# EAGLE design MaxO (EAGLE 5.04)
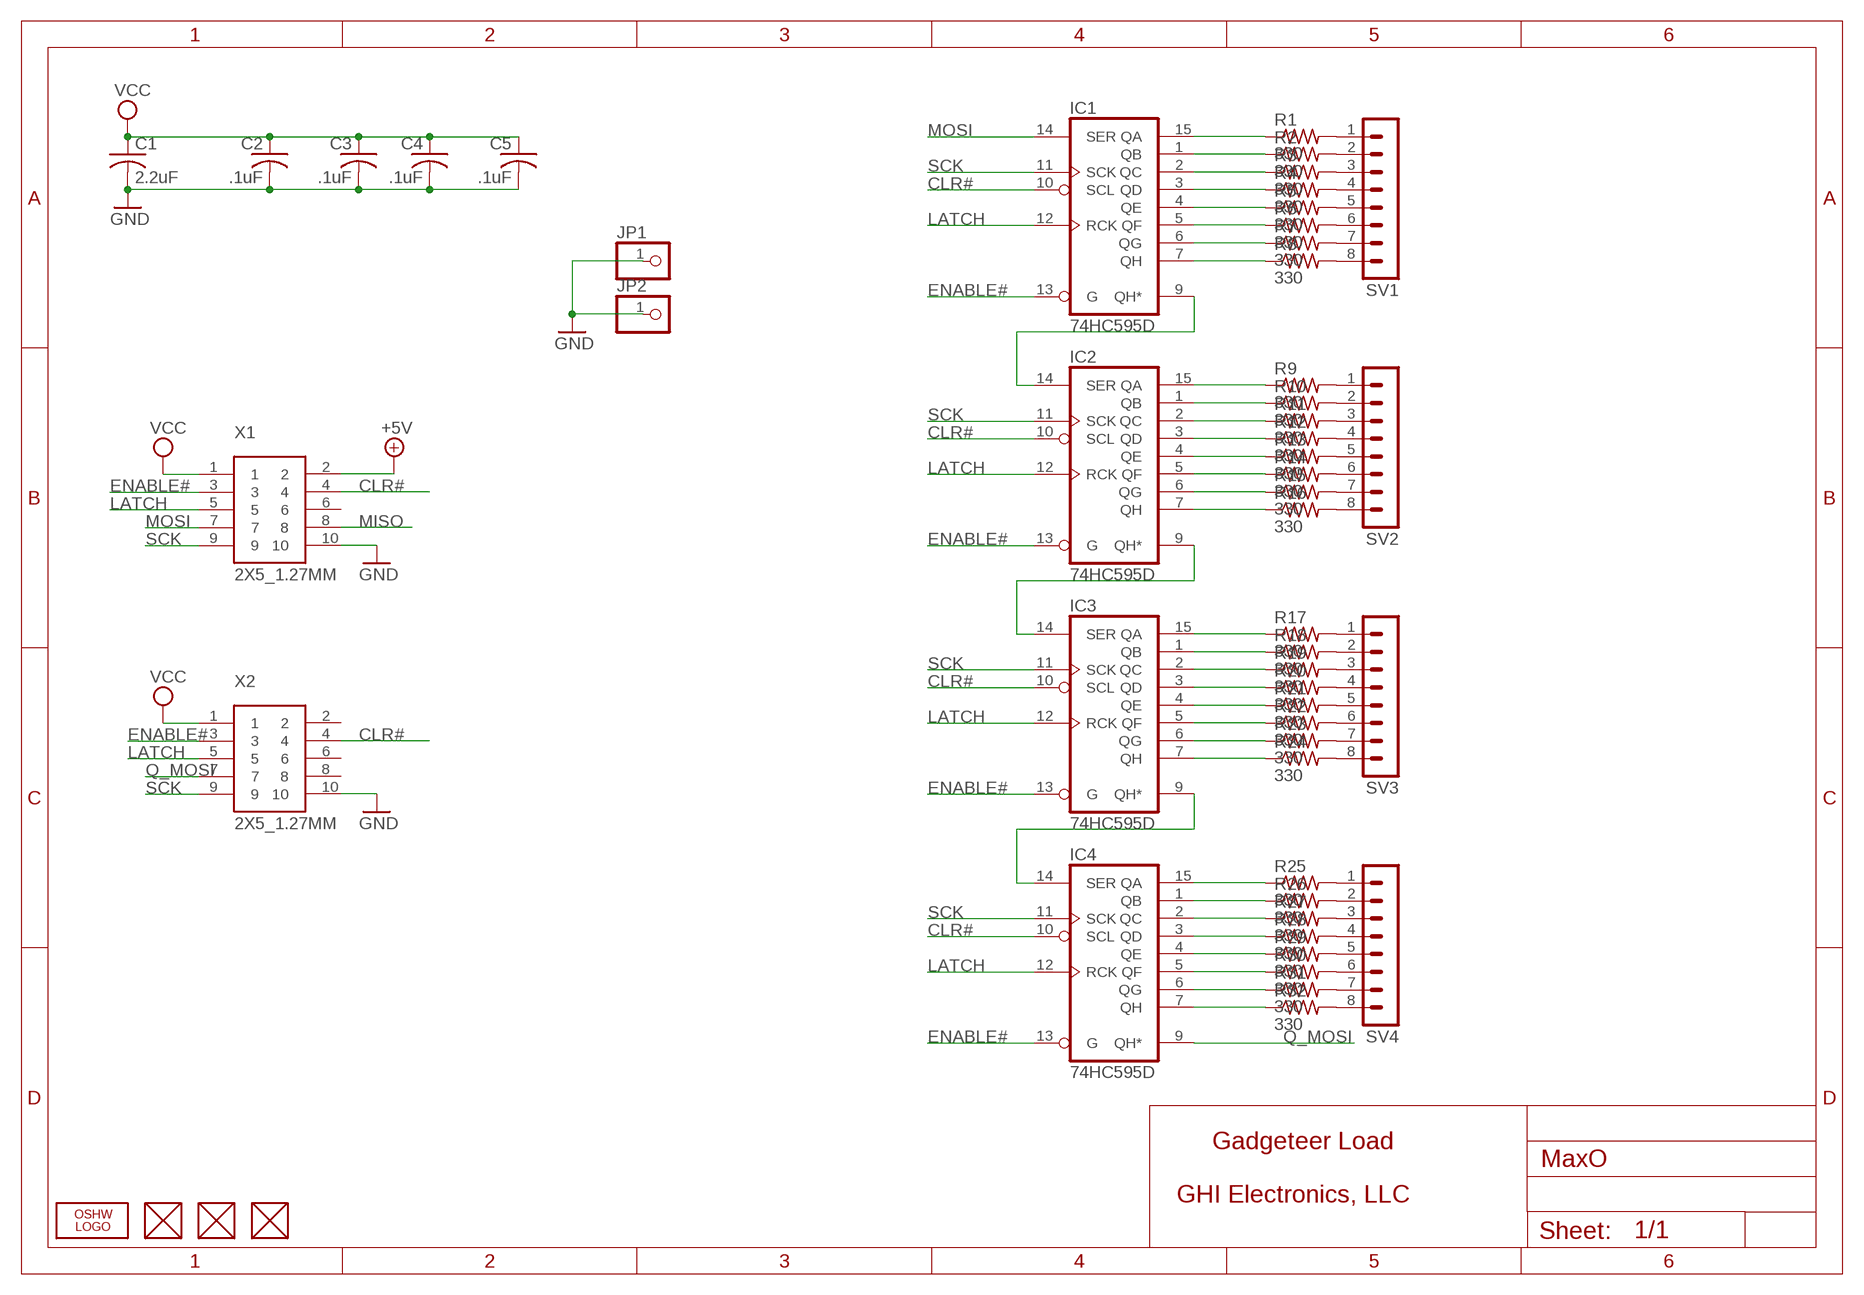
[diagram p0: schematic, sheet 1]

## Parts
C1  2.2uF  C-USC0805K  [C0805K]
C2  .1uF  C-USC0603K  [C0603K]
C3  .1uF  C-USC0603K  [C0603K]
C4  .1uF  C-USC0603K  [C0603K]
C5  .1uF  C-USC0603K  [C0603K]
FUD1  FIDUCIAL  [FIDUCIAL_40MIL]
FUD2  FIDUCIAL  [FIDUCIAL_40MIL]
FUD3  FIDUCIAL  [FIDUCIAL_40MIL]
IC1  74HC595D  74LS595D  [SO16]
IC2  74HC595D  74LS595D  [SO16]
IC3  74HC595D  74LS595D  [SO16]
IC4  74HC595D  74LS595D  [SO16]
JP1  PINHD-1X1  [1X01]
JP2  PINHD-1X1  [1X01]
LOGO1  LOGO-OSHW-FILLX0200-NT  [OSHW_FILLX200_NOTEXT]
R1  330  R-US_R0603  [R0603]
R2  330  R-US_R0603  [R0603]
R3  330  R-US_R0603  [R0603]
R4  330  R-US_R0603  [R0603]
R5  330  R-US_R0603  [R0603]
R6  330  R-US_R0603  [R0603]
R7  330  R-US_R0603  [R0603]
R8  330  R-US_R0603  [R0603]
R9  330  R-US_R0603  [R0603]
R10  330  R-US_R0603  [R0603]
R11  330  R-US_R0603  [R0603]
R12  330  R-US_R0603  [R0603]
R13  330  R-US_R0603  [R0603]
R14  330  R-US_R0603  [R0603]
R15  330  R-US_R0603  [R0603]
R16  330  R-US_R0603  [R0603]
R17  330  R-US_R0603  [R0603]
R18  330  R-US_R0603  [R0603]
R19  330  R-US_R0603  [R0603]
R20  330  R-US_R0603  [R0603]
R21  330  R-US_R0603  [R0603]
R22  330  R-US_R0603  [R0603]
R23  330  R-US_R0603  [R0603]
R24  330  R-US_R0603  [R0603]
R25  330  R-US_R0603  [R0603]
R26  330  R-US_R0603  [R0603]
R27  330  R-US_R0603  [R0603]
R28  330  R-US_R0603  [R0603]
R29  330  R-US_R0603  [R0603]
R30  330  R-US_R0603  [R0603]
R31  330  R-US_R0603  [R0603]
R32  330  R-US_R0603  [R0603]
SV1  MA08-1  [MA08-1]
SV2  MA08-1  [MA08-1]
SV3  MA08-1  [MA08-1]
SV4  MA08-1  [MA08-1]
X1  2X5_1.27MM  [2X5_1.27MM]
X2  2X5_1.27MM  [2X5_1.27MM]

## Nets
+5V [power]: X1.2
CLR#: IC1.10(SCL) IC2.10(SCL) IC3.10(SCL) IC4.10(SCL) X1.4 X2.4
ENABLE#: IC1.13(G) IC2.13(G) IC3.13(G) IC4.13(G) X1.3 X2.3
GND [power]: C1.2 C2.2 C3.2 C4.2 C5.2 JP1.1 JP2.1 X1.10 X2.10
LATCH: IC1.12(RCK) IC2.12(RCK) IC3.12(RCK) IC4.12(RCK) X1.5 X2.5
MISO: X1.8
MOSI: IC1.14(SER) X1.7
N$1: IC1.15(QA) R1.1
N$2: IC1.1(QB) R2.1
N$3: IC1.2(QC) R3.1
N$4: IC1.3(QD) R4.1
N$5: IC1.4(QE) R5.1
N$6: IC1.5(QF) R6.1
N$7: IC1.6(QG) R7.1
N$8: IC1.7(QH) R8.1
N$9: IC2.15(QA) R9.1
N$10: IC2.1(QB) R10.1
N$11: IC2.2(QC) R11.1
N$12: IC2.3(QD) R12.1
N$13: IC2.4(QE) R13.1
N$14: IC2.5(QF) R14.1
N$15: IC2.6(QG) R15.1
N$17: IC2.7(QH) R16.1
N$18: IC3.15(QA) R17.1
N$19: IC3.1(QB) R18.1
N$20: IC3.2(QC) R19.1
N$21: IC3.3(QD) R20.1
N$22: IC3.4(QE) R21.1
N$23: IC3.5(QF) R22.1
N$24: IC1.9(QH*) IC2.14(SER)
N$25: IC2.9(QH*) IC3.14(SER)
N$26: IC3.9(QH*) IC4.14(SER)
N$27: R1.2 SV1.1
N$28: R2.2 SV1.2
N$29: R3.2 SV1.3
N$30: IC3.6(QG) R23.1
N$31: IC3.7(QH) R24.1
N$32: IC4.15(QA) R25.1
N$33: IC4.1(QB) R26.1
N$34: IC4.2(QC) R27.1
N$35: IC4.3(QD) R28.1
N$36: IC4.4(QE) R29.1
N$37: IC4.5(QF) R30.1
N$38: IC4.6(QG) R31.1
N$39: IC4.7(QH) R32.1
N$40: R4.2 SV1.4
N$41: R5.2 SV1.5
N$42: R6.2 SV1.6
N$43: R7.2 SV1.7
N$44: R8.2 SV1.8
N$45: R32.2 SV4.8
N$46: R31.2 SV4.7
N$47: R30.2 SV4.6
N$48: R28.2 SV4.4
N$49: R29.2 SV4.5
N$50: R27.2 SV4.3
N$51: R26.2 SV4.2
N$52: R25.2 SV4.1
N$53: R24.2 SV3.8
N$54: R23.2 SV3.7
N$55: R22.2 SV3.6
N$56: R21.2 SV3.5
N$57: R20.2 SV3.4
N$58: R18.2 SV3.2
N$59: R19.2 SV3.3
N$60: R17.2 SV3.1
N$61: R16.2 SV2.8
N$62: R14.2 SV2.6
N$63: R13.2 SV2.5
N$64: R12.2 SV2.4
N$65: R11.2 SV2.3
N$66: R10.2 SV2.2
N$67: R9.2 SV2.1
N$68: R15.2 SV2.7
Q_MOSI: IC4.9(QH*) X2.7
SCK: IC1.11(SCK) IC2.11(SCK) IC3.11(SCK) IC4.11(SCK) X1.9 X2.9
VCC [power]: C1.1 C2.1 C3.1 C4.1 C5.1 X1.1 X2.1
Unconnected: FUD1.P$1 FUD2.P$1 FUD3.P$1 X1.6 X2.2 X2.6 X2.8

## Notes on the sheet
- Gadgeteer Load
- GHI Electronics, LLC

## Power pins joined to a net without a drawn wire
GND: IC1.8(GND) IC2.8(GND) IC3.8(GND) IC4.8(GND)
VCC: IC1.16(VCC) IC2.16(VCC) IC3.16(VCC) IC4.16(VCC)

## Library data of the parts
C1-C5 = rcl:C-US: CAPACITOR, American symbol
FUD1-FUD3 = GHI:FIDUCIAL
IC1-IC4 = 74xx-us:74*595: 8-bit SHIFT REGISTER, output latch
JP1 JP2 = pinhead:PINHD-1X1: PIN HEADER
LOGO1 = Logo:LOGO-OSHW-FILL
R1-R32 = rcl:R-US_: RESISTOR, American symbol
SV1-SV4 = con-lstb:MA08-1: PIN HEADER
X1 X2 = GHI:2X5_1.27MM

## Board
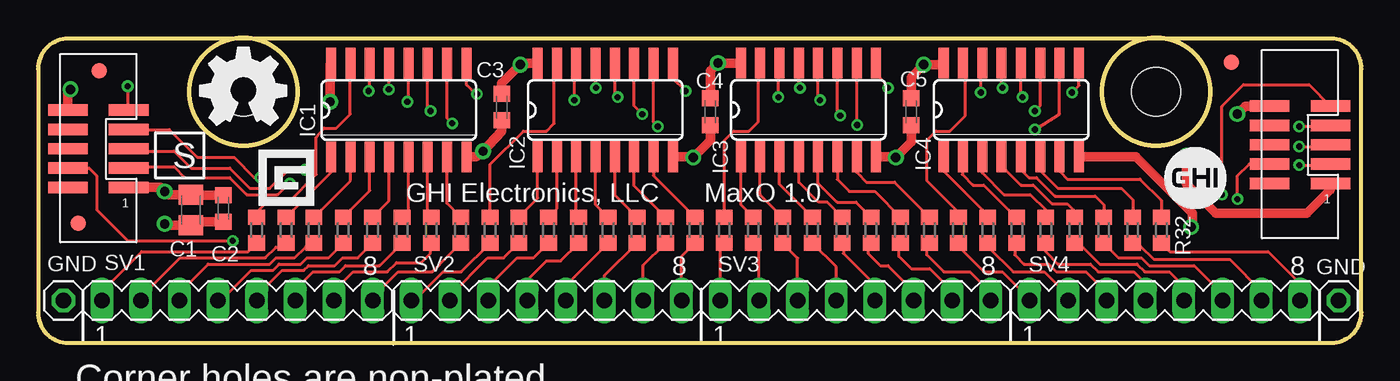
[diagram p1: board, top side]
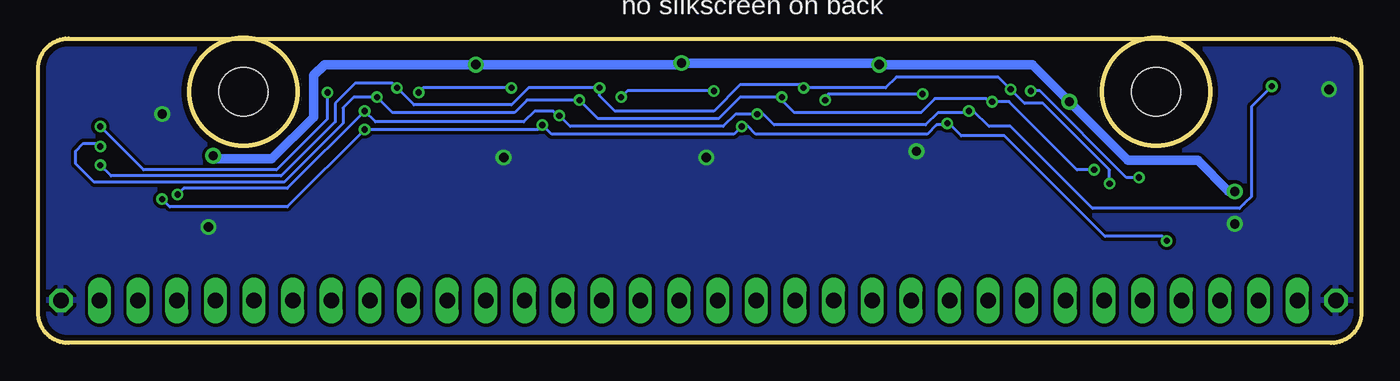
[diagram p2: board, bottom side, seen from below]

Size 87 x 20.04 mm. Coordinates in mm from the lower left corner, seen from the top.
Outline: 0,2 arc90 2,0 85,0 arc90 87,2 87,18 arc90 85,20 2,20 arc90 0,18 0,2
Outline: circle at 73.5,16.5 radius 3.54
Outline: circle at 13.5,16.5 radius 3.54
Copper layers (1+16): Top 0.035mm / dielectric 1.5mm / Bottom 0.035mm
Design rules "default *": minimum track width 8mil, minimum drill 12mil, track to track 8mil, track to pad 8mil, pad to pad 8mil, via to via 8mil, smd to smd 8mil, copper to edge 15mil, drill to drill 8mil, minimum pad ring 10mil, minimum via ring 7mil, stop-mask expansion 4mil, vias tented up to drill 50mil, thermal gap 10mil
Holes 3.2 mm at 13.5,16.5 73.5,16.5

### Footprints (pad centres in the part's own frame; a part is rotated, then mirrored left to right if it is on the bottom)
C0805K = smd 1.3 x 1.6: 1 -1,0; 2 1,0
C0603K = smd 1.05 x 1.08: 1 -0.875,0; 2 0.875,0
FIDUCIAL_40MIL = smd 1.016 x 1.016: P$1 0,0
SO16 = smd 0.66 x 2.032: 1 -4.445,-3.073; 2 -3.175,-3.073; 3 -1.905,-3.073; 4 -0.635,-3.073; 5 0.635,-3.073; 6 1.905,-3.073; 7 3.175,-3.073; 8 4.445,-3.073; 9 4.445,3.073; 10 3.175,3.073; 11 1.905,3.073; 12 0.635,3.073; 13 -0.635,3.073; 14 -1.905,3.073; 15 -3.175,3.073; 16 -4.445,3.073
1X01 = drill 1.016 octagon: 1 0,0
R0603 = smd 1 x 1.1: 1 -0.85,0; 2 0.85,0
MA08-1 = drill 1.016 long: 1 -8.89,0; 2 -6.35,0; 3 -3.81,0; 4 -1.27,0; 5 1.27,0; 6 3.81,0; 7 6.35,0; 8 8.89,0
2X5_1.27MM = smd 2.6 x 0.74: 1 -2,2.58; 2 2,2.58; 3 -2,1.31; 4 2,1.31; 5 -2,0.04; 6 2,0.04; 7 -2,-1.23; 8 2,-1.23; 9 -2,-2.5; 10 2,-2.5

### Placement (x,y rotation side)
C1  10.06,8.74 270 top
C2  12.19,8.84 270 top
C3  30.48,15.49 270 top
C4  44.2,15.19 270 top
C5  57.4,15.19 270 top
FUD1  78.46,18.43 0 top
FUD2  4.01,17.89 0 top
FUD3  2.63,7.86 0 top
IC1  23.71,15.29 0 top
IC2  37.28,15.3 0 top
IC3  50.64,15.32 0 top
IC4  63.98,15.32 0 top
JP1  1.68,2.79 0 top
JP2  85.5,2.79 0 top
LOGO1  10.66,14.33 0 top
R1  14.38,7.42 270 top
R2  16.31,7.42 270 top
R3  18.14,7.42 270 top
R4  20.07,7.42 270 top
R5  22,7.42 270 top
R6  23.93,7.42 270 top
R7  25.86,7.42 270 top
R8  27.79,7.42 270 top
R9  29.72,7.42 270 top
R10  31.6,7.42 270 top
R11  33.55,7.42 270 top
R12  35.53,7.42 270 top
R13  37.47,7.42 270 top
R14  39.37,7.42 270 top
R15  41.25,7.42 270 top
R16  43.18,7.42 270 top
R17  45.11,7.42 270 top
R18  47.02,7.42 270 top
R19  48.95,7.42 270 top
R20  50.9,7.42 270 top
R21  52.86,7.42 270 top
R22  54.76,7.42 270 top
R23  56.69,7.42 270 top
R24  58.6,7.42 270 top
R25  60.5,7.42 270 top
R26  62.43,7.42 270 top
R27  64.34,7.42 270 top
R28  66.24,7.42 270 top
R29  68.15,7.42 270 top
R30  70.05,7.42 270 top
R31  71.96,7.42 270 top
R32  73.84,7.42 270 top
SV1  13.11,2.79 0 top
SV2  33.43,2.79 0 top
SV3  53.75,2.79 0 top
SV4  74.07,2.79 0 top
X1  3.96,12.8 180 top
X2  82.96,13.06 180 top

### Tracks (layer width: path | path; a pad name or v marks a point on that pad's centre or on a via)
CLR#  (via drill 0.41)
  Top 0.203: IC1.10 26.89,14.77 v27.23,14.43 | IC2.10 40.46,14.51 v40.74,14.22 | IC3.10 53.82,14.35 v53.85,14.33 | IC4.10 67.15,15.04 v65.53,14.02 | X2.4 79.62,11.75 78.84,10.97 v78.84,9.45 | v12.8,6.71 5.89,6.71 3.86,8.74 3.86,10.97 3.35,11.48 1.97,11.48 X1.4
  Bottom 0.203: 27.03,14.33 27.94,14.33 28.55,13.72 39.83,13.72 40.34,14.22 v40.74,14.22 41.25,13.72 53.24,13.72 v53.85,14.33 54.15,14.02 v65.53,14.02 70.61,8.94 78.33,8.94 v78.84,9.45 | 27.03,14.33 26.31,13.61 23.47,13.61 16.87,7.01 13.11,7.01 v12.8,6.71 | 27.03,14.33 27.13,14.33 v27.23,14.43
ENABLE#  (via drill 0.41)
  Top 0.203: IC1.13 23.08,16.68 v23.06,16.66 | IC3.13 50.01,16.84 v50.09,16.76 | IC4.13 63.34,16.82 v63.4,16.76 | v82.91,11.68 84.89,11.68 X2.3 | IC2.13 36.65,16.79 v36.68,16.76 | v16.56,10.46 16.56,10.57 15.75,9.75 13.72,9.75 12.6,10.87 9.65,10.87 8.94,11.58 6.6,11.58 6.5,11.68 6.16,11.68 X1.3
  Bottom 0.203: v82.91,11.68 82.19,10.97 71.02,10.97 67.46,14.53 67.46,15.75 66.14,17.07 63.7,17.07 v63.4,16.76 62.28,15.65 55.88,15.65 54.76,16.76 v50.09,16.76 50.09,16.26 49.07,15.24 42.57,15.24 40.84,16.97 36.78,16.97 v36.68,16.76 31.29,16.76 30.58,17.48 23.88,17.48 v23.06,16.66 22.15,15.75 20.93,15.75 16.56,11.38 v16.56,10.46
GND  (via drill 0.61)
  Top 0.61: X2.10 79.37,15.56 v78.84,15.04 | IC3.8 56.33,12.25 v56.39,12.19 57.4,13.21 C5.2 | IC2.8 43.04,12.23 v43.08,12.19 44.2,13.31 C4.2 | IC1.8 28.78,12.22 v29.26,12.6 30.48,13.92 C3.2 | X1.10 1.96,16.49 v2.13,16.66 | IC4.8 72.18,12.25 75.89,8.53 75.89,7.72 v75.79,7.62 | C2.2 10.29,7.96 C1.2 8.42,7.74 v8.33,7.82
  pour Bottom: 87.07,20.32 0.1,20.32 0.1,-0.41 87.07,-0.41
LATCH  (via drill 0.41)
  Top 0.203: IC2.12 37.92,16.34 v38.1,16.15 | IC3.12 51.28,16.08 v51.41,15.95 | IC4.12 64.61,16.26 v64.72,16.15 | IC1.12 24.35,15.92 v24.28,15.85 | v82.91,12.9 84.84,12.9 X2.5 | v17.58,11.38 16.46,11.38 15.24,10.16 13.92,10.16 12.6,11.48 10.06,11.48 8.94,12.6 6.12,12.6 X1.5
  Bottom 0.203: v82.91,12.9 83.11,13.11 84.02,13.11 84.53,12.6 84.53,11.79 83.31,10.57 70.81,10.57 66.95,14.43 66.95,15.44 66.24,16.15 v64.72,16.15 63.7,15.14 55.68,15.14 54.86,15.95 v51.41,15.95 50.19,14.73 42.27,14.73 40.84,16.15 v38.1,16.15 38.1,15.95 37.29,15.14 28.96,15.14 28.04,16.05 24.69,16.05 24.49,15.85 v24.28,15.85 23.16,15.85 18.69,11.38 v17.58,11.38
MOSI  (via drill 0.41)
  Top 0.203: IC1.14 21.81,16.63 v21.74,16.56 | v14.63,10.87 14.22,10.87 12.9,12.19 10.46,12.19 8.64,14.02 5.97,14.02 X1.7
  Bottom 0.203: v21.74,16.56 21.13,16.56 15.44,10.87 v14.63,10.87
N$1
  Top 0.203: R1.1 14.38,8.59 | 14.38,8.59 14.33,8.53 | 14.38,8.59 15.04,9.25 16.46,9.25 18.29,11.07 18.29,13.51 18.8,14.12 19.61,14.12 20.52,15.04 20.52,18.35 IC1.15
N$2
  Top 0.203: IC1.1 19.27,11.23 R2.1
N$3
  Top 0.203: IC1.2 20.54,10.67 R3.1
N$4
  Top 0.203: IC1.3 21.81,10.01 R4.1
N$5
  Top 0.203: IC1.4 23.08,9.35 R5.1
N$6
  Top 0.203: IC1.5 24.35,8.69 R6.1
N$7
  Top 0.203: IC1.6 25.62,8.51 R7.1
N$8
  Top 0.203: IC1.7 26.89,9.16 R8.1
N$9
  Top 0.203: R9.1 29.72,11.73 31.9,13.92 33.43,13.92 33.93,14.43 33.93,18.2 IC2.15
N$10
  Top 0.203: IC2.1 32.84,9.51 R10.1
N$11
  Top 0.203: IC2.2 34.11,8.82 R11.1
N$12
  Top 0.203: IC2.3 35.38,8.42 R12.1
N$13
  Top 0.203: IC2.4 36.65,9.08 R13.1
N$14
  Top 0.203: IC2.5 37.92,9.72 R14.1
N$15
  Top 0.203: IC2.6 39.19,10.33 R15.1
N$17
  Top 0.203: IC2.7 40.46,10.99 R16.1
N$18
  Top 0.203: R17.1 45.11,13.31 45.72,13.92 46.74,13.92 47.35,14.53 47.35,18.27 IC3.15
N$19
  Top 0.203: IC3.1 46.2,9.08 R18.1
N$20
  Top 0.203: IC3.2 47.47,9.74 R19.1
N$21
  Top 0.203: IC3.3 48.74,10.43 R20.1
N$22
  Top 0.203: IC3.4 50.01,10.54 51.31,9.25 51.88,9.25 R21.1
N$23
  Top 0.203: IC3.5 51.28,10.49 52.53,9.25 53.78,9.25 R22.1
N$24  (via drill 0.41)
  Top 0.203: v28.85,16.36 28.85,16.26 28.16,16.95 IC1.9 | v35.26,15.95 35.26,18.25 IC2.14
  Bottom 0.203: v28.85,16.36 35.05,16.36 v35.26,15.95
N$25  (via drill 0.41)
  Top 0.203: IC2.9 41.73,17.81 41.76,17.37 v42.57,16.56 | v48.67,16.15 48.67,18.32 IC3.14
  Bottom 0.203: v42.57,16.56 48.26,16.56 v48.67,16.15
N$26  (via drill 0.41)
  Top 0.203: IC3.9 55.27,18.39 55.27,17.48 55.88,16.87 v55.88,16.76 | v61.98,16.46 61.98,18.3 IC4.14
  Bottom 0.203: v55.88,16.76 61.67,16.76 v61.98,16.46
N$27
  Top 0.203: SV1.1 4.22,3.4 6.81,5.99 13.8,5.99 R1.2
N$28
  Top 0.203: SV1.2 6.76,3 9.35,5.59 14.94,5.59 15.65,6.3 16.04,6.3 R2.2
N$29
  Top 0.203: SV1.3 9.3,3.3 11.18,5.18 15.24,5.18 15.65,5.59 16.87,5.59 17.58,6.3 17.87,6.3 R3.2
N$30
  Top 0.203: IC3.6 52.55,10.75 53.34,9.96 55,9.96 R23.1
N$31
  Top 0.203: IC3.7 53.82,11.21 54.46,10.57 56.3,10.57 R24.1
N$32
  Top 0.203: R25.1 60.5,8.59 58.42,10.67 58.42,13.31 59.03,13.92 59.94,13.92 60.96,14.94 60.96,18.24 IC4.15
N$33
  Top 0.203: R26.1 62.43,8.38 59.54,11.28 IC4.1
N$34
  Top 0.203: R27.1 64.28,8.27 62.18,10.36 61.47,10.36 60.76,11.07 60.76,12.2 IC4.2
N$35
  Top 0.203: R28.1 66.24,8.74 65.23,9.75 63.5,9.75 62.08,11.18 IC4.3
N$36
  Top 0.203: R29.1 68.15,8.66 67.67,9.14 66.65,9.14 65.43,10.36 64.62,10.36 63.4,11.58 63.4,12.19 IC4.4
N$37
  Top 0.203: R30.1 70.05,9.09 69.49,9.65 66.85,9.65 65.63,10.87 65.13,10.87 64.52,11.48 64.52,12.15 IC4.5
N$38
  Top 0.203: R31.1 71.96,9.42 71.22,10.16 67.06,10.16 65.94,11.28 65.94,12.19 IC4.6
N$39
  Top 0.203: R32.1 73.84,9.37 72.44,10.77 67.67,10.77 67.16,11.28 IC4.7
N$40
  Top 0.203: SV1.4 12.04,2.79 14.02,4.78 15.44,4.78 15.85,5.18 17.27,5.18 17.68,5.59 19.09,5.59 R4.2
N$41
  Top 0.203: SV1.5 14.38,3.1 16.05,4.78 17.48,4.78 17.78,5.08 19.51,5.08 20.02,5.59 21.02,5.59 R5.2
N$42
  Top 0.203: SV1.6 16.92,3.5 18.09,4.67 19.81,4.67 20.22,5.08 22.44,5.08 R6.2
N$43
  Top 0.203: SV1.7 19.46,3.4 20.73,4.67 22.96,4.67 23.57,5.28 25.2,5.28 25.81,5.89 25.81,6.52 R7.2
N$44
  Top 0.203: SV1.8 22,3 23.67,4.67 25.91,4.67 26.42,5.18 26.42,5.2 R8.2
N$45
  Top 0.203: SV4.8 82.96,3.91 80.87,5.99 74.41,5.99 R32.2
N$46
  Top 0.203: SV4.7 80.42,3.4 78.33,5.49 73.36,5.49 72.44,6.4 72.12,6.4 R31.2
N$47
  Top 0.203: SV4.6 77.88,3.2 76,5.08 73.05,5.08 72.54,5.59 71.03,5.59 R30.2
N$48
  Top 0.203: SV4.4 72.8,3.91 72.03,4.67 69.7,4.67 69.19,5.18 67.06,5.18 66.24,5.99 R28.2
N$49
  Top 0.203: SV4.5 75.34,3.71 74.37,4.67 72.75,4.67 72.24,5.18 69.8,5.18 68.68,6.3 68.42,6.3 R29.2
N$50
  Top 0.203: SV4.3 70.26,3.3 68.89,4.67 66.95,4.67 66.45,5.18 64.82,5.18 64.21,5.79 64.21,6.44 R27.2
N$51
  Top 0.203: SV4.2 67.72,3.1 66.14,4.67 64.11,4.67 62.48,6.3 62.48,6.52 R26.2
N$52
  Top 0.203: SV4.1 65.18,2.9 63.4,4.67 62.18,4.67 60.55,6.3 60.45,6.52 R25.2
N$53
  Top 0.203: SV3.8 62.64,3.3 61.27,4.67 59.54,4.67 58.42,5.79 58.42,6.39 R24.2
N$54
  Top 0.203: SV3.7 60.1,3.4 58.62,4.88 57.4,4.88 56.59,5.69 56.59,6.46 R23.2
N$55
  Top 0.203: SV3.6 57.56,3.4 55.88,5.08 55.37,5.08 54.56,5.89 54.56,6.36 R22.2
N$56
  Top 0.203: SV3.5 55.02,3.81 52.93,5.89 52.93,6.49 R21.2
N$57
  Top 0.203: SV3.4 52.48,4.99 R20.2
N$58
  Top 0.203: SV3.2 47.4,6.19 R18.2
N$59
  Top 0.203: SV3.3 49.94,5.58 R19.2
N$60
  Top 0.203: SV3.1 44.86,6.31 R17.2
N$61
  Top 0.203: SV2.8 42.32,5.7 R16.2
N$62
  Top 0.203: SV2.6 37.24,4.43 R14.2
N$63
  Top 0.203: SV2.5 34.7,3.8 R13.2
N$64
  Top 0.203: SV2.4 32.16,4.12 33.43,5.38 34.35,5.38 R12.2
N$65
  Top 0.203: SV2.3 29.62,3.71 31.5,5.59 32.58,5.59 R11.2
N$66
  Top 0.203: SV2.2 27.08,3.1 29.57,5.59 30.62,5.59 R10.2
N$67
  Top 0.203: SV2.1 24.74,2.79 26.62,4.67 27.82,4.67 R9.2
N$68
  Top 0.203: SV2.7 39.78,5.09 R15.2
Q_MOSI  (via drill 0.41)
  Top 0.203: IC4.9 68.42,16.91 v67.97,16.46 | v82.91,14.22 84.89,14.22 X2.7
  Bottom 0.203: v67.97,16.46 67.97,14.73 71.32,11.38 80.06,11.38 v82.91,14.22
SCK  (via drill 0.41)
  Top 0.203: IC1.11 25.62,15.43 v25.81,15.24 | IC2.11 39.19,15.57 v39.73,15.04 | IC3.11 52.55,15.12 v52.73,14.94 | IC4.11 65.88,15.6 v65.53,15.24 | v77.83,9.75 77.83,15.54 79.25,16.97 83.55,16.97 X2.9 | v5.89,16.87 5.89,15.37 X1.9
  Bottom 0.203: v77.83,9.75 77.42,10.16 70.61,10.16 v65.53,15.24 64.82,14.53 55.07,14.53 54.36,15.24 53.14,15.24 52.83,14.94 v52.73,14.94 52.02,14.22 41.96,14.22 41.15,15.04 v39.73,15.04 39.32,15.04 38.61,14.33 28.65,14.33 27.84,15.14 25.91,15.14 v25.81,15.24 25.5,15.24 24.49,14.22 23.06,14.22 17.68,8.84 8.03,8.84 7.72,9.14 7.21,9.65 7.21,15.54 v5.89,16.87
VCC  (via drill 0.61)
  Top 0.61: X1.1 8.07,10.22 v8.33,9.96 8.55,9.74 C1.1 10.08,9.71 C2.1 | v19.2,15.85 19.2,18.3 IC1.16 | IC2.16 31.79,18.38 v31.7,18.29 30.48,17.07 C3.1 | IC3.16 v44.71,18.39 v44.7,18.39 44.2,17.88 C4.1 | X2.1 84.96,10.08 83.41,8.53 77.42,8.53 75.49,10.46 v75.49,12.29 | IC4.16 59.43,18.29 v58.22,18.29 57.4,17.48 C5.1
  Bottom 0.61: v8.33,9.96 8.74,9.96 10.77,11.99 15.34,11.99 v19.2,15.85 21.64,18.29 v31.7,18.29 31.79,18.38 32.31,18.38 32.32,18.39 v44.7,18.39 44.81,18.29 v58.22,18.29 68.17,18.29 68.89,17.58 68.89,14.83 71.63,12.09 75.39,12.09 75.49,12.19 v75.49,12.29

### Text on the board
tPlace: S | GHI Electronics, LLC MaxO 1.0 | GND | GND | Corner holes are non-plated | black PCB with white text | do not add manufacturing codes
bPlace: no silkscreen on back